# EasyEDA Pro project 1.eprj

# Schematic TEST
Create Date: 2023-04-09; Page Name: P1; Project Name: New Project_2023-04-09_10-10-50; Schematic Name: TEST; Update Date: 2023-04-14; Company: 嘉立创EDA; Page Size: A4; Version: V1.0
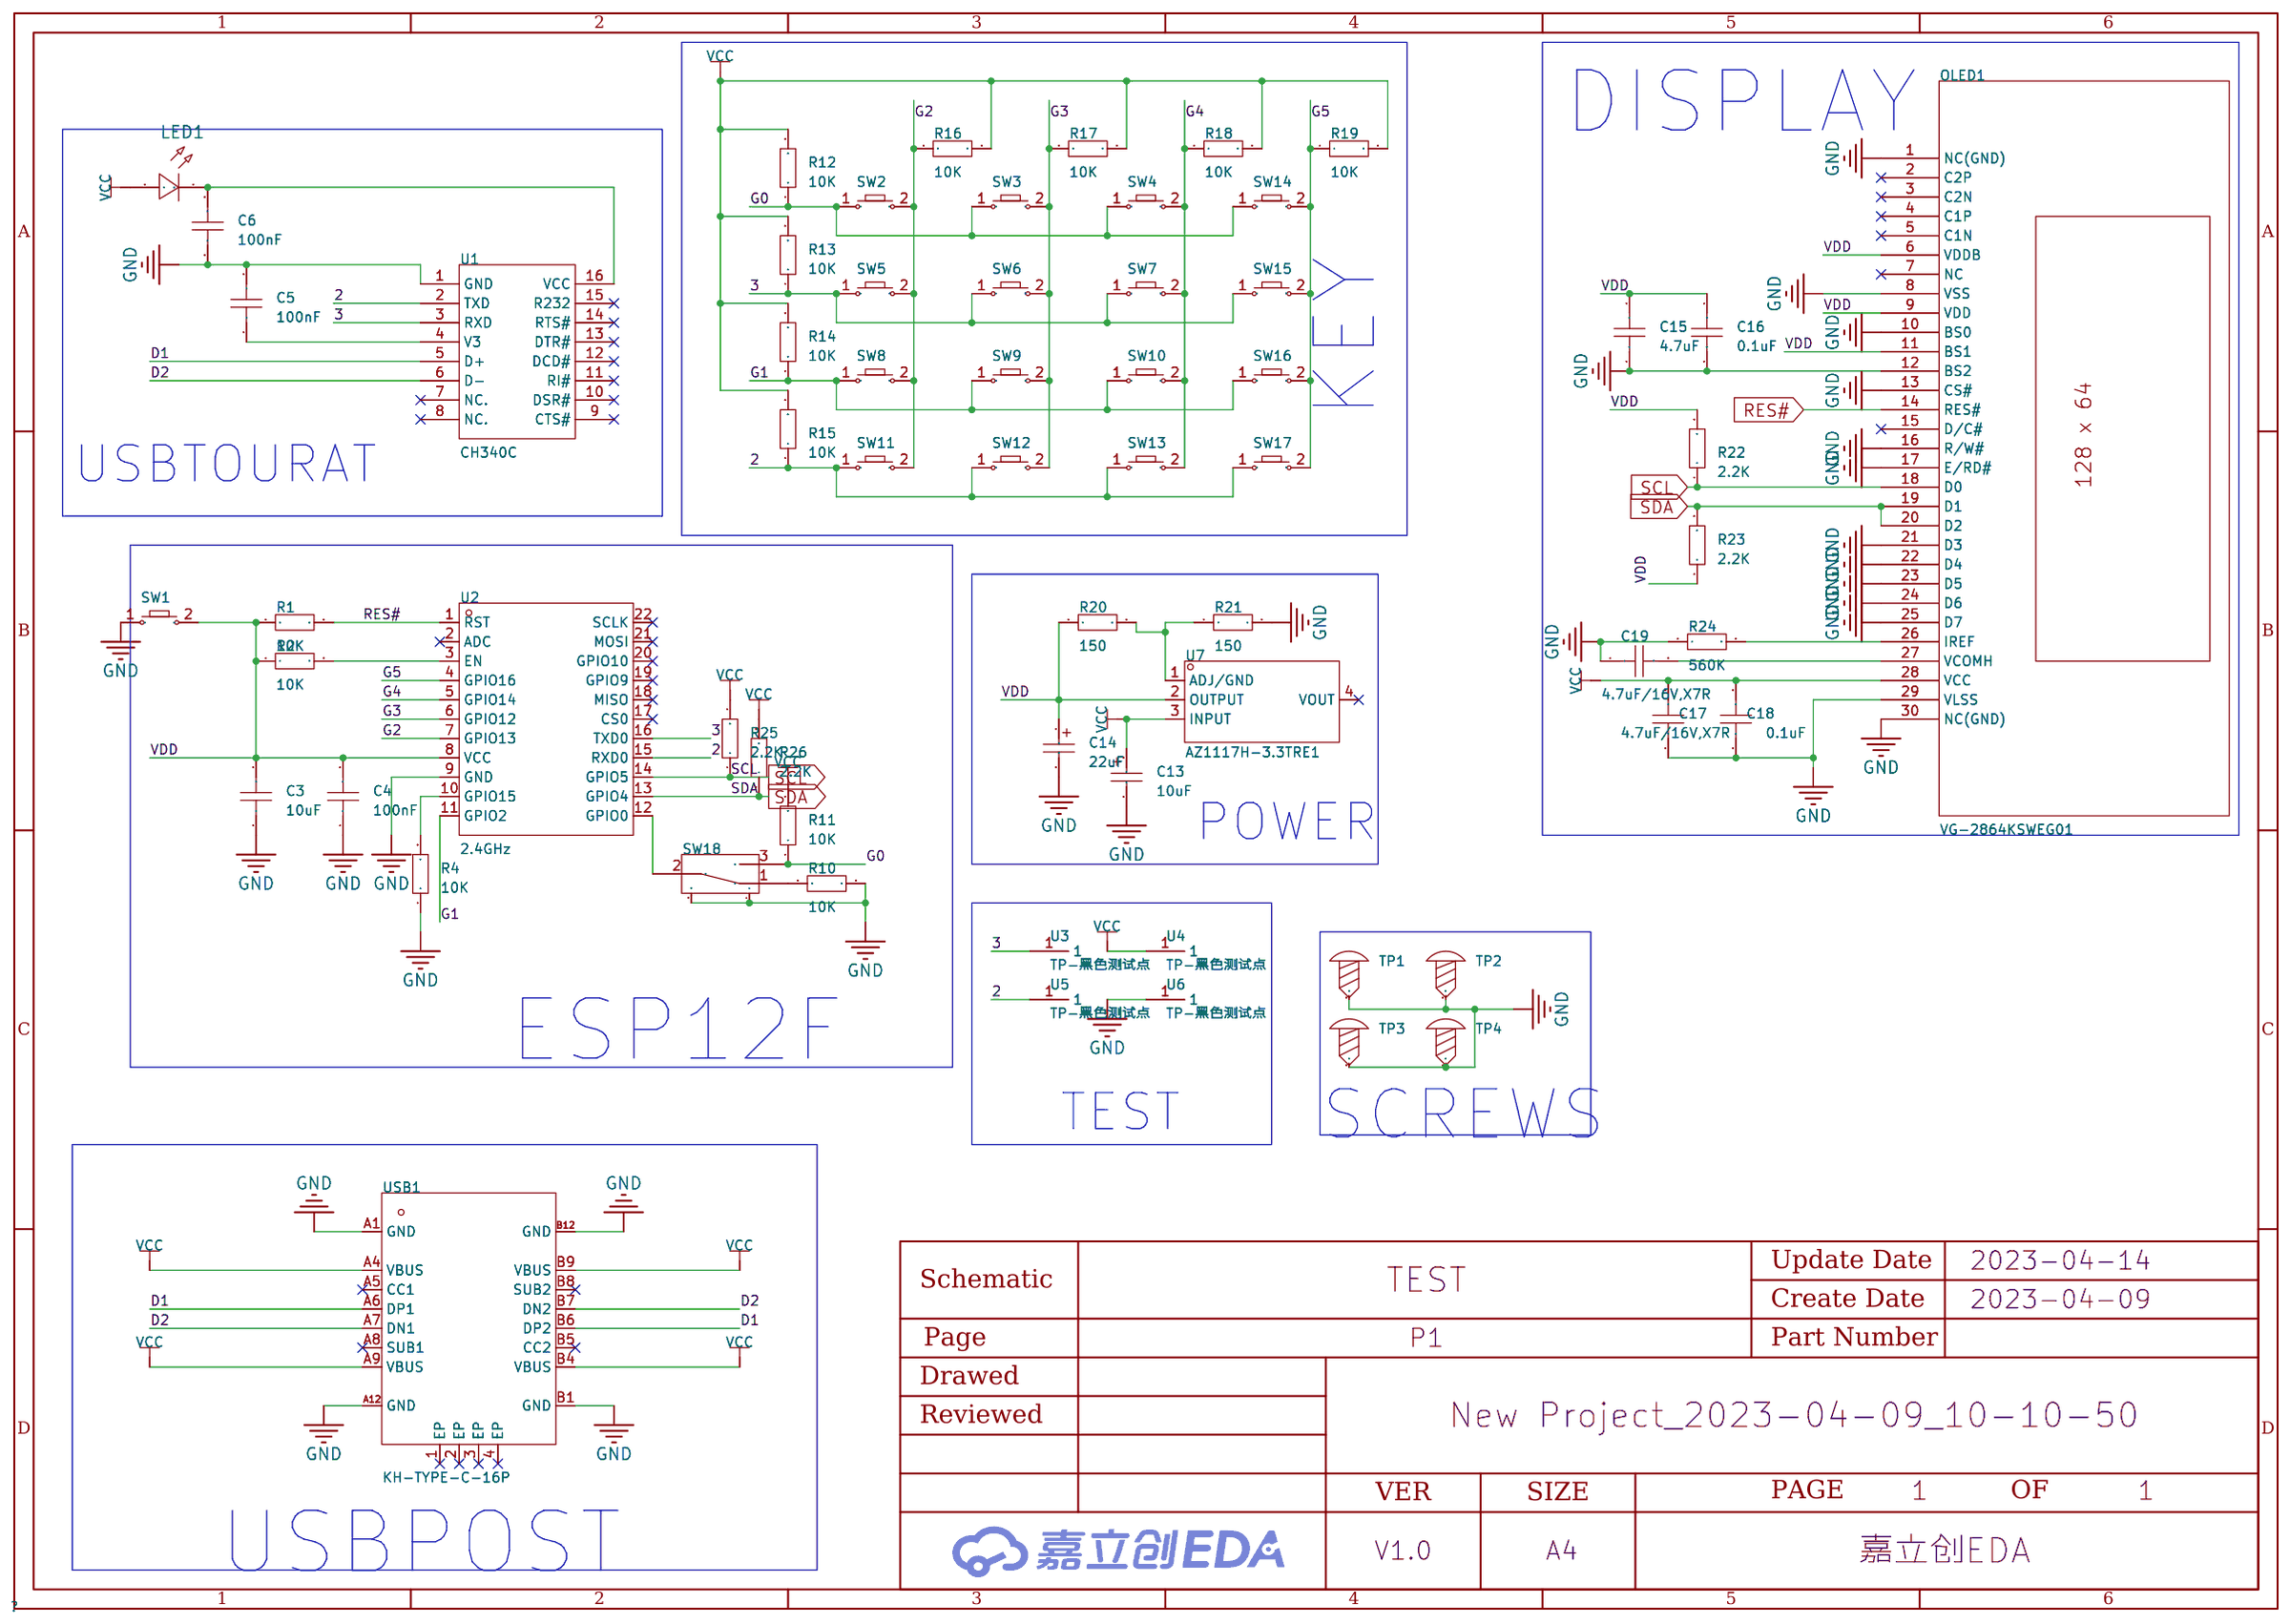
[diagram p0: schematic sheet]

## Parts
C3  10uF  [C0805]
C4  100nF  [C0805]
C5  100nF  [C0805]
C6  100nF  [C0805]
C13  10uF  [CAP-SMD_L3.2-W1.6-RD-C7171]
C14  22uF  [CASE-B_3528]
C15  4.7uF  [C0805]
C16  0.1uF  [C0805]
C17  4.7uF/16V,X7R  [C0805]
C18  0.1uF  [C0805]
C19  4.7uF/16V,X7R  [C0805]
LED1  -  [LED_0805]
OLED1  VG-2864KSWEG01  [OLED_0.96-30P-P0.70-12864]
R1  10K  [R0805]
R2  10K  [R0805]
R4  10K  [R0805]
R10  10K  [R0805]
R11  10K  [R0805]
R12  10K  [R0805]
R13  10K  [R0805]
R14  10K  [R0805]
R15  10K  [R0805]
R16  10K  [R0805]
R17  10K  [R0805]
R18  10K  [R0805]
R19  10K  [R0805]
R20  150  [R0805]
R21  150  [R0805]
R22  2.2K  [R0805]
R23  2.2K  [R0805]
R24  560K  [R0805]
R25  2.2K  [R0805]
R26  2.2K  [R0805]
SW1  -  [Key_SMD_3x4x2]
SW2  -  [Key_SMD_3x4x2]
SW3  -  [Key_SMD_3x4x2]
SW4  -  [Key_SMD_3x4x2]
SW5  -  [Key_SMD_3x4x2]
SW6  -  [Key_SMD_3x4x2]
SW7  -  [Key_SMD_3x4x2]
SW8  -  [Key_SMD_3x4x2]
SW9  -  [Key_SMD_3x4x2]
SW10  -  [Key_SMD_3x4x2]
SW11  -  [Key_SMD_3x4x2]
SW12  -  [Key_SMD_3x4x2]
SW13  -  [Key_SMD_3x4x2]
SW14  -  [Key_SMD_3x4x2]
SW15  -  [Key_SMD_3x4x2]
SW16  -  [Key_SMD_3x4x2]
SW17  -  [Key_SMD_3x4x2]
SW18  -  [拨动开关_侧]
TP1  -  [M2螺丝]
TP2  -  [M2螺丝]
TP3  -  [M2螺丝]
TP4  -  [M2螺丝]
U1  CH340C  [SOP-16_L10.0-W3.9-P1.27-LS6.0-BL]
U2  2.4GHz  [WIFIM-SMD_ESP-12F-ESP8266MOD]
U3  TP-黑色测试点  [TESTPOINT-TH_BD3.2]
U4  TP-黑色测试点  [TESTPOINT-TH_BD3.2]
U5  TP-黑色测试点  [TESTPOINT-TH_BD3.2]
U6  TP-黑色测试点  [TESTPOINT-TH_BD3.2]
U7  AZ1117H-3.3TRE1  [SOT-223-3_L6.5-W3.4-P2.30-LS7.0-BR]
USB1  KH-TYPE-C-16P  [USB-C-SMD_KH-TYPE-C-16P]

## Library data of the parts
C3-C6 C15-C19 = CAP_0805: Supplier Footprint: 0805
C13 = TAJA106K016RNJ: 容值:10uF;精度:±10%;额定电压:16V;等效串联电阻:3Ω@100kHz;; LCSC Part Name: 10uF ±10% 16V; Supplier Part: C7171; Manufacturer: Kyocera AVX; Supplier Footprint: CASE-A-3216; JLCPCB Part Class: Basic Part; Datasheet: https://atta.szlcsc.com/upload/public/pdf/source/20160107/1457707748093.pdf; Supplier: LCSC; Tolerance: ±10%; Rated Voltage: 16V; Equivalent Series Resistance(ESR): 3Ω@100kHz; Operating Temperature: -55℃~+125℃
C14 = TAJB226K016RNJ: 容值:22uF;精度:±10%;额定电压:16V;等效串联电阻:2.3Ω@100kHz;; LCSC Part Name: 22uF ±10% 16V; Supplier Part: C8020; Manufacturer: Kyocera AVX; Supplier Footprint: CASE-B-3528; JLCPCB Part Class: Extended Part; Datasheet: https://atta.szlcsc.com/upload/public/pdf/source/20160107/1457707749964.pdf; Supplier: LCSC; Tolerance: ±10%; Rated Voltage: 16V; Equivalent Series Resistance(ESR): 2.3Ω@100kHz; Operating Temperature: -55℃~+125℃
LED1 = LED_0805-R: Supplier Footprint: 0805
OLED1 = VG-2864KSWEG01: 尺寸(inch):0.96;主控芯片:SSD1306;; LCSC Part Name: 0.96”128x64白色 VG-2864KSWEG01; Supplier Part: C194313; Manufacturer: WiseChip(智晶光电); JLCPCB Part Class: Extended Part; Datasheet: https://atta.szlcsc.com/upload/public/pdf/source/20190118/C194313_EB7CEF44C1C1CB8B071218A368D72B17.pdf; Supplier: LCSC; Size: 0.96; Main Control Chip: SSD1306
R1 R2 R4 R10-R26 = Res_0805: Supplier Footprint: 0805
SW1-SW17 = Key_SMD_3x4x2: Supplier Footprint: SMD
SW18 = 拨动开关_侧: Supplier Footprint: 插件
TP1-TP4 = M2螺丝: Supplier Footprint: 插件
U1 = CH340C: 驱动器/接收器数:-;协议类别:USB 2.0;类型:Transceiver;数据速率:2Mbps;; Supplier Part: C84681; Manufacturer: WCH(南京沁恒); Supplier Footprint: SOP-16_150mil; JLCPCB Part Class: Extended Part; Datasheet: https://atta.szlcsc.com/upload/public/pdf/source/20200819/C84681_ADBED554CE321879DBD6B1D06488689C.pdf; Supplier: LCSC; Protocol: USB 2.0; Type: Transceiver; Supply Voltage: 3.3V, 5V; Data Rate: 2Mbps
U2 = ESP-12F(ESP8266MOD): 频率:2.4GHz;发射功率:16dBm;核心处理器:ESP8266;天线形式:PCB 板载天线;接收灵敏度:-90dBm;; Supplier Part: C82891; Manufacturer: Ai-Thinker(安信可); Supplier Footprint: SMD,16x24mm; JLCPCB Part Class: Extended Part; Datasheet: https://atta.szlcsc.com/upload/public/pdf/source/20210219/C82891_ABD84A460F4F056A2757267CCCA4B508.pdf; Supplier: LCSC; Output Power: 16dBm; Core Processor: ESP8266; Support Interface: GPIO；UART；I2C；PWM；SPI；ADC; Antenna Type: PCB 板载天线; Wireless Standard: 802.11b/g/n; Operating Voltage: 3.3V; Receive  Current: 120mA; Send  Current: 170mA; Sensitivity: -90dBm; Operating Temperature: -40℃~+85℃
U3-U6 = TP-黑色测试点: Supplier Part: C9900007426; Supplier Footprint: TESTPOINT-TH_BD-2P-P2.00; JLCPCB Part Class: Extended Part; Supplier: LCSC
U7 = AZ1117H-3.3TRE1: 最大输入电压:15V;压降(max):1.25V @ 1A;输出电压(可调):-;静态电流(Iq):-;输出类型:固定;输出电压(固定):3.3V;; Supplier Part: C92517; Manufacturer: DIODES(美台); Supplier Footprint: SOT-223; JLCPCB Part Class: Extended Part; Datasheet: https://atta.szlcsc.com/upload/public/pdf/source/20170213/1486952240805.pdf; Supplier: LCSC; Voltage - Input (Max): 15V; Voltage Dropout (Max): 1.25V @ 1A; Output Current (Max): 1A; Output Configuration: 正; Ripple Rejection (PSRR): 75dB(120Hz); Output Type: 固定; Number of Output Channels: 1; Operating Temperature: -40℃~125℃(TJ); Voltage - Output (Fixed): 3.3V
USB1 = KH-TYPE-C-16P: Type-C母座 16PIN 立式四角贴板无压片; LCSC Part Name: Type-C母座; Supplier Part: C709357; Manufacturer: kinghelm(金航标); JLCPCB Part Class: Extended Part; Datasheet: https://atta.szlcsc.com/upload/public/pdf/source/20200911/C709357_AA8DCEB38BB20E3035A7ED7AE7667837.pdf; Supplier: LCSC

## Nets
GND: C3.1 C4.1 C5.2 C6.1 C13.2 C14.2 C15.2 C16.2 C17.1 C18.1 C19.1 OLED1.1(NC(GND)) OLED1.8(VSS) OLED1.10(BS0) OLED1.12(BS2) OLED1.13(CS#) OLED1.16(R/W#) OLED1.17(E/RD#) OLED1.21(D3) OLED1.22(D4) OLED1.23(D5) OLED1.24(D6) OLED1.25(D7) OLED1.29(VLSS) OLED1.30(NC(GND)) R4.1 R10.2 R21.2 R24.1 SW1.1 SW18.4 SW18.5 TP1.1 TP2.1 TP3.1 TP4.1 U1.1(GND) U2.9(GND) U6.1 USB1.A1(GND) USB1.A12(GND) USB1.B1(GND) USB1.B12(GND)
VCC: C13.1 C17.2 C18.2 LED1.2(A) OLED1.28(VCC) R11.2 R12.2 R13.2 R14.2 R15.2 R16.2 R17.2 R18.2 R19.2 R25.2 R26.2 U4.1 U7.3(INPUT) USB1.A4(VBUS) USB1.A9(VBUS) USB1.B4(VBUS) USB1.B9(VBUS)
VDD: C3.2 C4.2 C14.1 C15.1 C16.1 OLED1.6(VDDB) OLED1.9(VDD) OLED1.11(BS1) R1.1 R2.1 R20.1 R22.2 R23.1 SW1.2 U2.8(VCC) U7.2(OUTPUT)
2: R15.1 SW11.1 SW12.1 SW13.1 SW17.1 U1.2(TXD) U2.15(RXD0) U5.1
3: R13.1 SW5.1 SW6.1 SW7.1 SW15.1 U1.3(RXD) U2.16(TXD0) U3.1
D1: U1.5(D+) USB1.A6(DP1) USB1.B6(DP2)
D2: U1.6(D-) USB1.A7(DN1) USB1.B7(DN2)
G0: R11.1 R12.1 SW2.1 SW3.1 SW4.1 SW14.1 SW18.3
G1: R14.1 SW8.1 SW9.1 SW10.1 SW16.1 U2.11(GPIO2)
G2: R16.1 SW2.2 SW5.2 SW8.2 SW11.2 U2.7(GPIO13)
G3: R17.1 SW3.2 SW6.2 SW9.2 SW12.2 U2.6(GPIO12)
G4: R18.1 SW4.2 SW7.2 SW10.2 SW13.2 U2.5(GPIO14)
G5: R19.1 SW14.2 SW15.2 SW16.2 SW17.2 U2.4(GPIO16)
RES#: OLED1.14(RES#) R1.2 U2.1(RST)
SCL: OLED1.18(D0) R22.1 R25.1 U2.14(GPIO5)
SDA: OLED1.19(D1) OLED1.20(D2) R23.2 R26.1 U2.13(GPIO4)
$1N211: C5.1 U1.4(V3)
$1N397: C6.2 LED1.1(C) U1.16(VCC)
$1N1350: R2.2 U2.3(EN)
$1N1471: R4.2 U2.10(GPIO15)
$1N1478: SW18.2 U2.12(GPIO0)
$1N3612: R10.1 SW18.1
$1N7471: R20.2 R21.1 U7.1(ADJ/GND)
$1N8121: OLED1.26(IREF) R24.2
$1N8216: C19.2 OLED1.27(VCOMH)

Not connected (* = marked no-connect by the designer): OLED1 2(C2P)* 3(C2N)* 4(C1P)* 5(C1N)* 7(NC)* 15(D/C#)*; U1 7(NC.)* 8(NC.)* 9(CTS#)* 10(DSR#)* 11(RI#)* 12(DCD#)* 13(DTR#)* 14(RTS#)* 15(R232)*; U2 2(ADC)* 17(CS0)* 18(MISO)* 19(GPIO9)* 20(GPIO10)* 21(MOSI)* 22(SCLK)*; U7 4(VOUT)*; USB1 1(EP)* 2(EP)* 3(EP)* 4(EP)* A5(CC1)* A8(SUB1)* B5(CC2)* B8(SUB2)*

## Notes on the sheet
- DISPLAY
- KEY
- USBTOURAT
- POWER
- ESP12F
- TEST
- SCREWS
- USBPOST

# Board PCB2
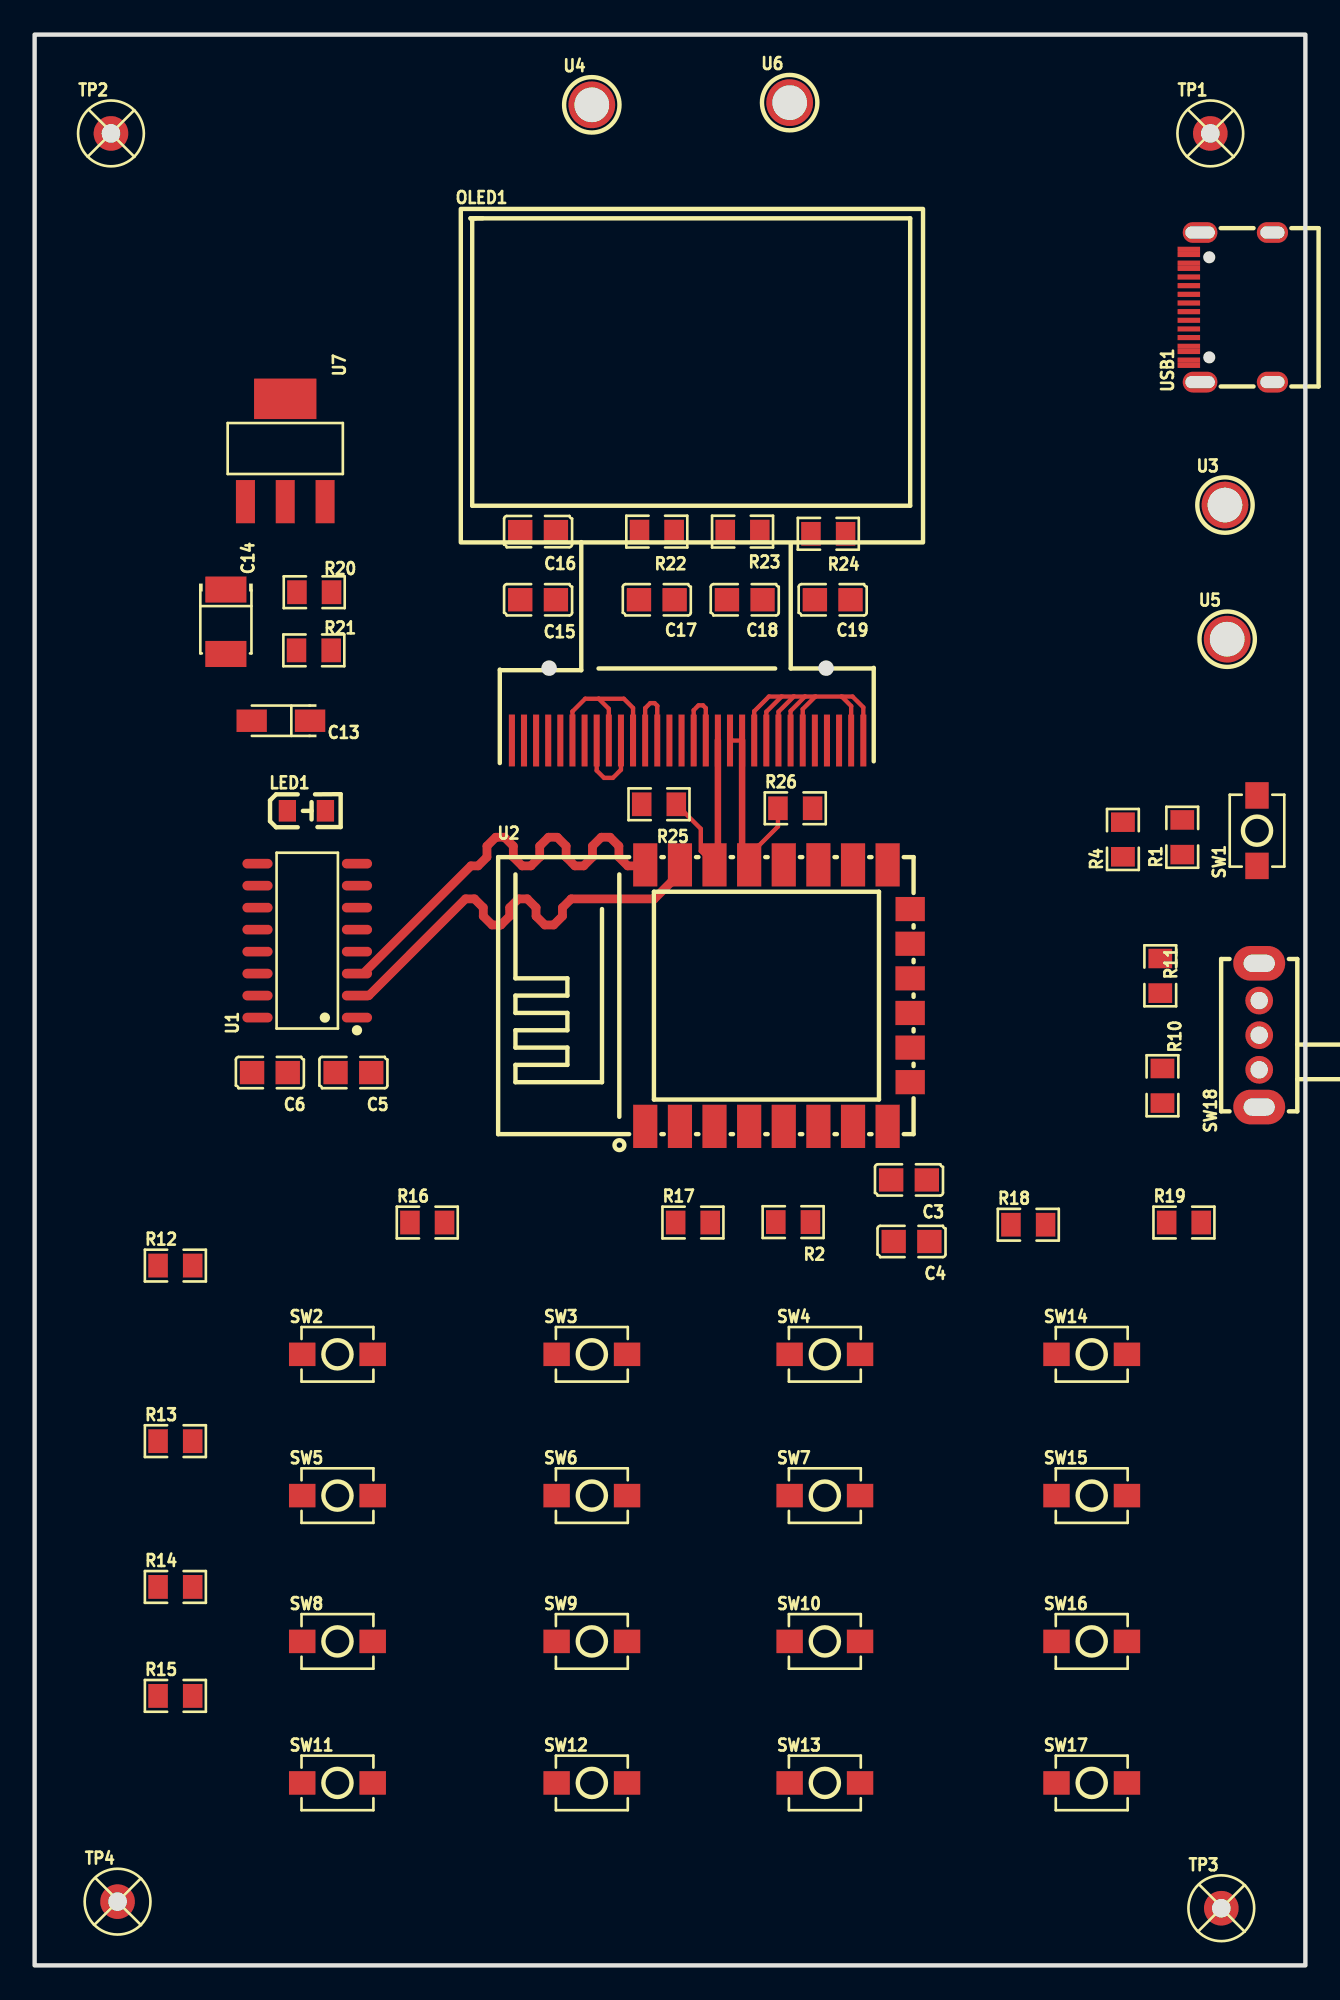
[diagram p1: board, top side]
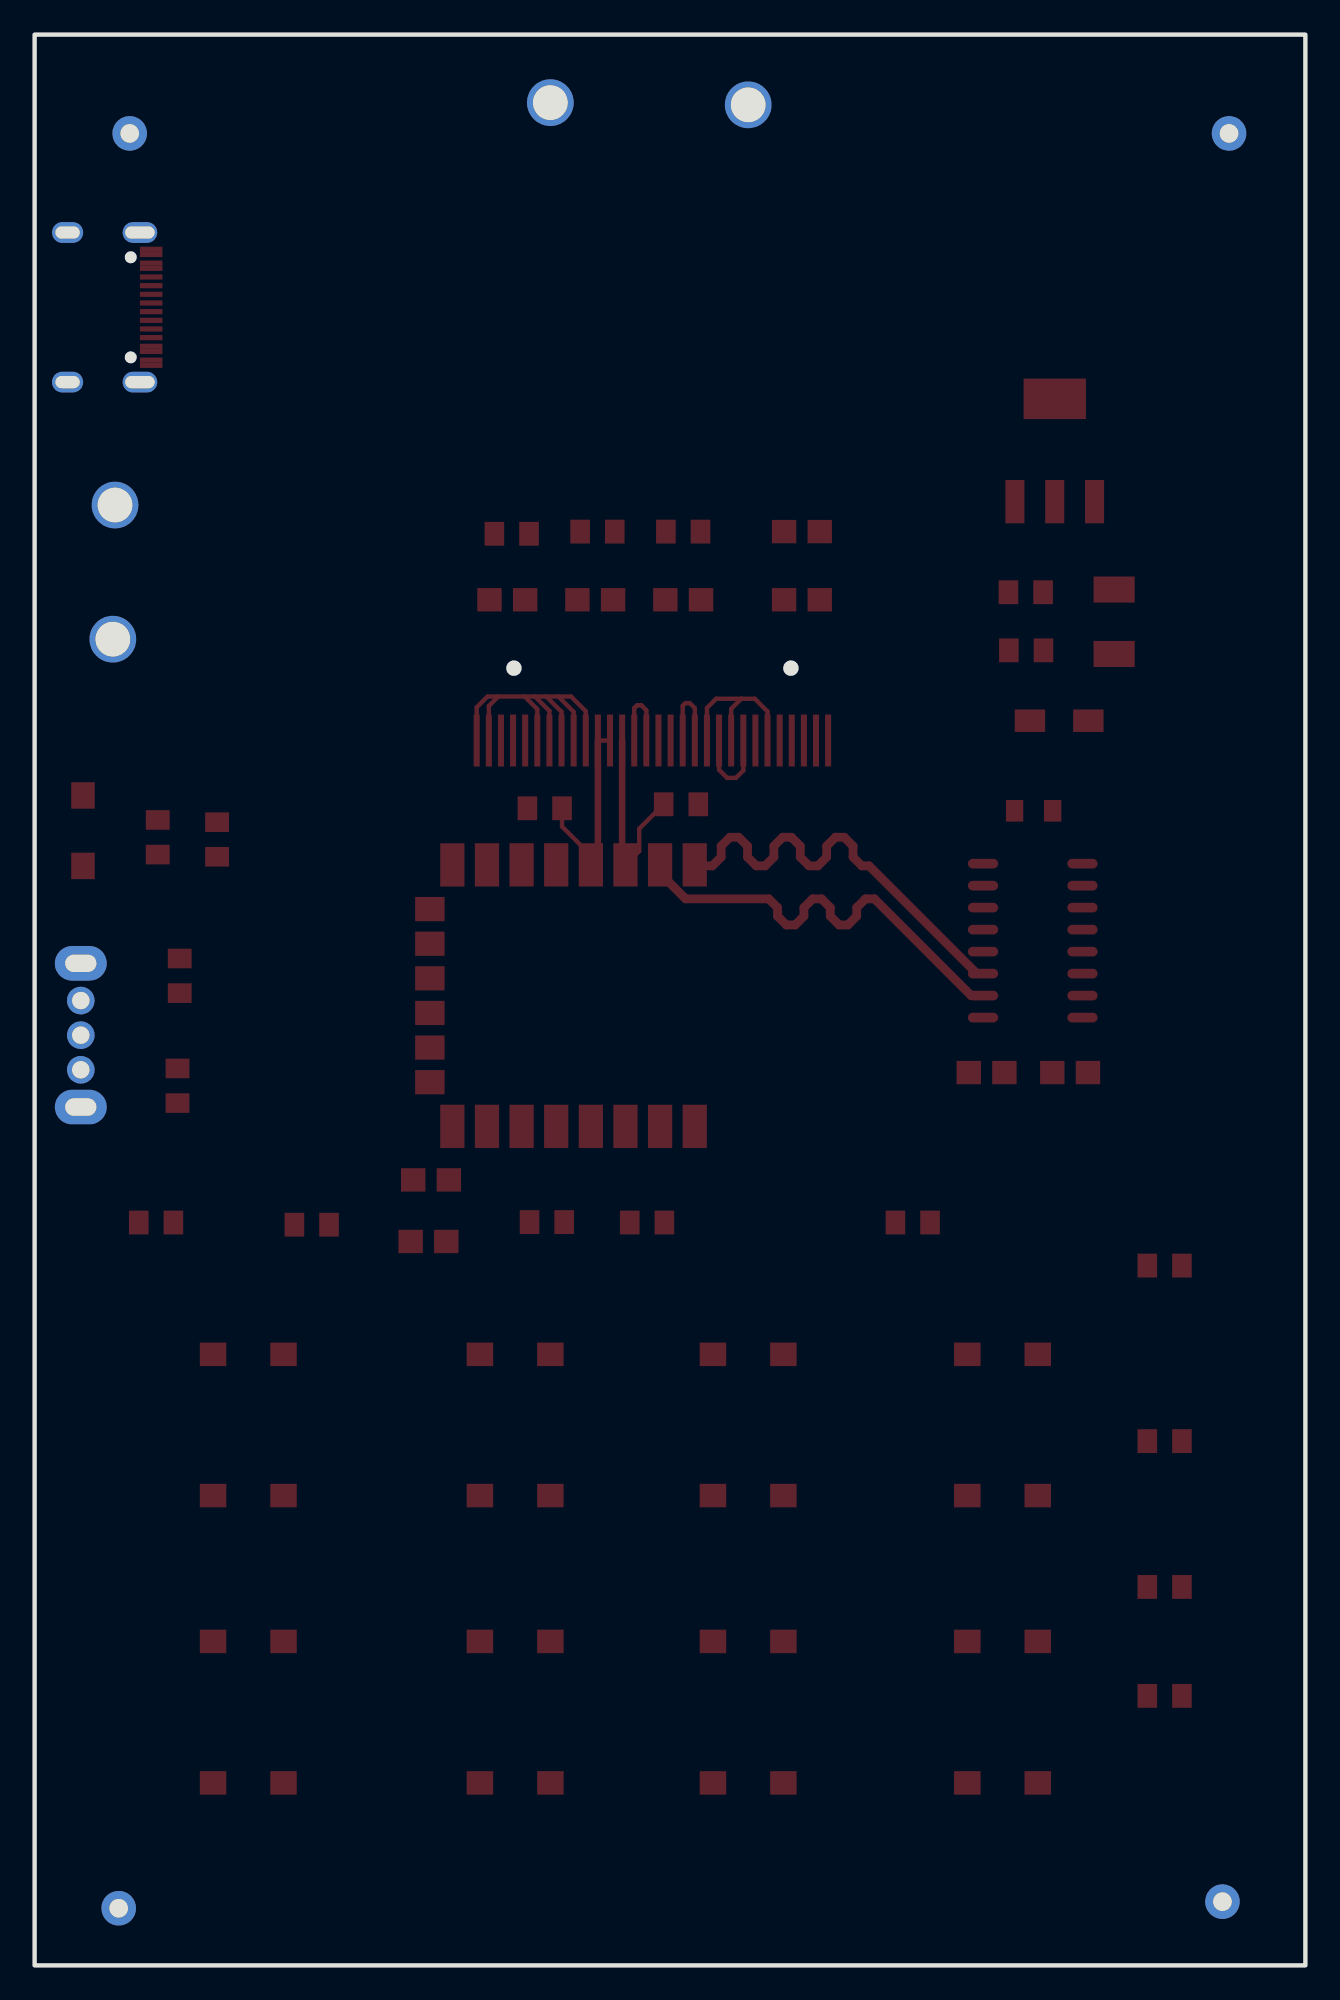
[diagram p2: board, bottom side, seen from below]

Outline 73.41 x 111.51 mm; copper layers: Top Layer, Bottom Layer. Coordinates in mm from the lower left corner of the outline.
Outline path: rectangle 0,111.51 73.41,0
Stack: Top Layer 0.035mm / Dielectric1 1.51mm FR4 er 4.5 / Bottom Layer 0.035mm

## Design rules (mm)
template: JLCPCB Capability(Two Layers Board)
spacing copperThickness1oz (default): track to track 0.102, other pairs 0.152 to 0.3
spacing copperThickness2oz: track to track 0.203, other pairs 0.152 to 0.3
track width copperThickness1oz (default): min 0.127, default 0.254, max 2.54
track width copperThickness2oz: min 0.203, default 0.254, max 2.54
differential pair differentialPair (default): width min 0.127, default 0.254, max 2.54; gap min 0.152, default 0.152
via viaSize (default): diameter min 0.5, default 0.61, max 10; hole min 0.3, default 0.305, max 6.3

## Placement (name value [footprint] x y rotation side)
C3  10uF  [C0805]  50.51 45.36 180 top
C4  100nF  [C0805]  50.65 41.81 180 top
C5  100nF  [C0805]  18.42 51.56 180 top
C6  100nF  [C0805]  13.59 51.56 180 top
C13  10uF  [CAP-SMD_L3.2-W1.6-RD-C7171]  14.22 71.88 180 top
C14  22uF  [CASE-B_3528]  11.05 77.6 270 top
C15  4.7uF  [C0805]  29.08 78.87 180 top
C16  0.1uF  [C0805]  29.08 82.8 180 top
C17  4.7uF/16V,X7R  [C0805]  35.94 78.87 0 top
C18  0.1uF  [C0805]  41.02 78.87 0 top
C19  4.7uF/16V,X7R  [C0805]  46.1 78.87 0 top
LED1  -  [LED_0805]  15.75 66.68 0 top
OLED1  VG-2864KSWEG01  [OLED_0.96-30P-P0.70-12864]  37.72 70.74 0 top
R1  10K  [R0805]  66.29 65.15 90 top
R2  10K  [R0805]  43.81 42.93 180 top
R4  10K  [R0805]  62.86 65.02 90 top
R10  10K  [R0805]  65.15 50.8 270 top
R11  10K  [R0805]  65.02 57.15 90 top
R12  10K  [R0805]  8.13 40.42 0 top
R13  10K  [R0805]  8.13 30.28 0 top
R14  10K  [R0805]  8.13 21.86 0 top
R15  10K  [R0805]  8.13 15.56 0 top
R16  10K  [R0805]  22.68 42.9 0 top
R17  10K  [R0805]  38.03 42.9 0 top
R18  10K  [R0805]  57.4 42.77 0 top
R19  10K  [R0805]  66.39 42.9 0 top
R20  150  [R0805]  16.15 79.3 180 top
R21  150  [R0805]  16.13 75.95 0 top
R22  2.2K  [R0805]  35.94 82.8 180 top
R23  2.2K  [R0805]  40.89 82.8 0 top
R24  560K  [R0805]  45.85 82.68 0 top
R25  2.2K  [R0805]  36.07 67.06 180 top
R26  2.2K  [R0805]  43.94 66.83 0 top
SW1  -  [Key_SMD_3x4x2]  70.61 65.53 90 top
SW2  -  [Key_SMD_3x4x2]  17.49 35.29 0 top
SW3  -  [Key_SMD_3x4x2]  32.19 35.29 0 top
SW4  -  [Key_SMD_3x4x2]  45.65 35.29 0 top
SW5  -  [Key_SMD_3x4x2]  17.49 27.13 0 top
SW6  -  [Key_SMD_3x4x2]  32.19 27.13 0 top
SW7  -  [Key_SMD_3x4x2]  45.65 27.13 0 top
SW8  -  [Key_SMD_3x4x2]  17.49 18.71 0 top
SW9  -  [Key_SMD_3x4x2]  32.19 18.71 0 top
SW10  -  [Key_SMD_3x4x2]  45.65 18.71 0 top
SW11  -  [Key_SMD_3x4x2]  17.49 10.54 0 top
SW12  -  [Key_SMD_3x4x2]  32.19 10.54 0 top
SW13  -  [Key_SMD_3x4x2]  45.65 10.54 0 top
SW14  -  [Key_SMD_3x4x2]  61.06 35.29 0 top
SW15  -  [Key_SMD_3x4x2]  61.06 27.13 0 top
SW16  -  [Key_SMD_3x4x2]  61.06 18.71 0 top
SW17  -  [Key_SMD_3x4x2]  61.06 10.54 0 top
SW18  -  [拨动开关_侧]  70.74 53.72 90 top
TP1  -  [M2螺丝]  67.91 105.8 0 top
TP2  -  [M2螺丝]  4.41 105.8 0 top
TP3  -  [M2螺丝]  68.55 3.3 0 top
TP4  -  [M2螺丝]  4.79 3.68 0 top
U1  CH340C  [SOP-16_L10.0-W3.9-P1.27-LS6.0-BL]  15.75 59.18 90 top
U2  2.4GHz  [WIFIM-SMD_ESP-12F-ESP8266MOD]  42.93 56.01 0 top
U3  TP-黑色测试点  [TESTPOINT-TH_BD3.2]  68.76 84.34 0 top
U4  TP-黑色测试点  [TESTPOINT-TH_BD3.2]  32.19 107.45 0 top
U5  TP-黑色测试点  [TESTPOINT-TH_BD3.2]  68.89 76.59 0 top
U6  TP-黑色测试点  [TESTPOINT-TH_BD3.2]  43.62 107.58 0 top
U7  AZ1117H-3.3TRE1  [SOT-223-3_L6.5-W3.4-P2.30-LS7.0-BR]  14.48 87.5 270 top
USB1  KH-TYPE-C-16P  [USB-C-SMD_KH-TYPE-C-16P]  69.09 95.76 90 top

## Footprints (pads in the part's own frame, mm; a bottom-side part is the same pattern mirrored in y, then rotated)
C0805
  rect 1.41x1.35 smd: 1(-1.03,0) 2(1.03,0)
CAP-SMD_L3.2-W1.6-RD-C7171
  rect 1.758x1.296 smd: 1(-1.687,0) 2(1.687,0)
CASE-B_3528
  rect 1.506x2.376 smd: 1(-1.861,0) 2(1.861,0)
Key_SMD_3x4x2
  rect 1.53x1.36 smd: 1(-2.035,0) 2(2.035,0)
LED_0805
  rect 1x1.25 smd: 1(-1.15,0.005) 2(1.05,0.005)
M2螺丝
  round 2 hole 1.07: 1(0,0)
OLED_0.96-30P-P0.70-12864
  rect 0.35x3 smd: 1(-10.15,0.003) 2(-9.45,0.001) 3(-8.75,0.001) 4(-8.05,0.001) 5(-7.35,0.001) 6(-6.65,0.001) 7(-5.95,0.001) 8(-5.25,0.001) 9(-4.55,0.001) 10(-3.85,0.001) 11(-3.15,0.001) 12(-2.45,0.001) 13(-1.75,0.001) 14(-1.05,0.001) 15(-0.35,0.001) 16(0.35,0.001) 17(1.05,0.001) 18(1.75,0.001) 19(2.45,0.001) 20(3.15,0.001) 21(3.85,0.001) 22(4.55,0.001) 23(5.25,0.001) 24(5.95,0.001) 25(6.65,0.001) 26(7.35,0.001) 27(8.05,0.001) 28(8.75,-0.002) 29(9.45,-0.003) 30(10.15,-0.003)
R0805
  rect 1.133x1.377 smd: 1(-1,0) 2(1,0)
SOP-16_L10.0-W3.9-P1.27-LS6.0-BL
  oval 0.56x1.745 smd: 1(-4.445,-2.873) 2(-3.175,-2.873) 3(-1.905,-2.873) 4(-0.635,-2.873) 5(0.635,-2.873) 6(1.905,-2.873) 7(3.175,-2.873) 8(4.445,-2.873) 9(4.445,2.873) 10(3.175,2.873) 11(1.905,2.873) 12(0.635,2.873) 13(-0.635,2.873) 14(-1.905,2.873) 15(-3.175,2.873) 16(-4.445,2.873)
SOT-223-3_L6.5-W3.4-P2.30-LS7.0-BR
  rect 2.5x1.1 smd: 1(2.97,-2.3) 2(2.97,0) 3(2.97,2.3)
  rect 2.34x3.6 smd: 4(-2.97,0)
TESTPOINT-TH_BD3.2
  round 2.7 hole 2: 1(0,0)
USB-C-SMD_KH-TYPE-C-16P
  oval 1.2x2 hole 0.7x1.7: 1(-4.32,1.765) 2(4.32,1.765)
  oval 1.2x1.8 hole 0.7x1.4: 3(-4.32,-2.415) 4(4.32,-2.415)
  rect 0.3x1.3 smd: A1(-3.35,2.415) A4(-2.55,2.415) A5(-1.25,2.415) A6(-0.25,2.415) A7(0.25,2.415) A8(1.25,2.415) A9(2.55,2.415) A12(3.35,2.415) B1(3.05,2.415) B4(2.25,2.415) B5(1.75,2.415) B6(0.75,2.415) B7(-0.75,2.415) B8(-1.75,2.415) B9(-2.25,2.415) B12(-3.05,2.415)
WIFIM-SMD_ESP-12F-ESP8266MOD
  rect 1.4x2.5 smd: 1(-7.651,-7.551) 2(-5.651,-7.551) 3(-3.651,-7.551) 4(-1.651,-7.551) 5(0.349,-7.551) 6(2.349,-7.551) 7(4.349,-7.551) 8(6.349,-7.551) 9(6.349,7.548) 10(4.349,7.55) 11(2.349,7.551) 12(0.349,7.551) 13(-1.651,7.55) 14(-3.651,7.551) 15(-5.651,7.551) 16(-7.651,7.551)
  rect 1.7x1.4 smd: 17(7.651,-5) 18(7.649,-3.002) 19(7.649,-1.004) 20(7.649,0.998) 21(7.649,2.997) 22(7.651,4.997)
拨动开关_侧
  oval 1.6x1.6 hole 1.001: 1(-1.999,0) 2(0,0) 3(1.999,0)
  oval 1.999x2.999 hole 1.001x1.801: 4(4.151,0) 5(-4.151,0)

## Nets
As in the schematic.

Pads without a net: OLED1 2 3 4 5 7 15; U1 7 8 9 10 11 12 13 14 15; U2 2 17 18 19 20 21 22; U7 4; USB1 1 2 3 4 A5 A8 B5 B8

## Routing (per net, layer and track width the routed paths; a pad name or vN(x,y) marks a point on that pad's centre or on a via; arc(x,y) is an arc through that point)
GND: length 39.3
  Top Layer w0.254: 45.1,73.28 44.37,72.55 OLED1.25 ; 45.1,73.28 44.5,73.28 ; 45.1,73.28 46.62,73.28 ; OLED1.16 38.07,72.49 38.35,72.77 38.61,72.77 38.77,72.61 OLED1.17 ; OLED1.21 41.57,72.43 42.42,73.28 43.15,73.28 ; 44.5,73.28 43.67,72.45 OLED1.24 ; 44.5,73.28 43.85,73.28 ; OLED1.13 35.97,72.74 35.81,72.9 35.56,72.9 35.27,72.61 OLED1.12 ; 43.15,73.28 43.85,73.28 ; 43.15,73.28 42.27,72.4 OLED1.22 ; 43.85,73.28 42.97,72.4 OLED1.23 ; OLED1.8 32.47,69 32.89,68.58 33.4,68.58 33.87,69.05 OLED1.10 ; OLED1.29 47.17,72.73 46.62,73.28 ; OLED1.30 47.87,72.65 47.24,73.28 46.62,73.28
VDD: length 10.2
  Top Layer w0.254: 32.59,73.15 31.8,73.15 31.07,72.42 OLED1.6 ; 32.59,73.15 34.04,73.15 34.57,72.62 OLED1.11 34.56,70.73 ; 32.59,73.15 33.17,72.57 OLED1.9
2: length 25.6
  Top Layer w0.508: U1.2 19.3,56.01 24.89,61.6 25.41,61.6 25.92,61.09 25.92,60.6 26.43,60.09 26.93,60.09 27.44,60.6 27.44,61.09 27.95,61.6 28.46,61.6 28.97,61.09 28.97,60.6 29.47,60.09 29.98,60.09 30.49,60.6 30.49,61.09 31,61.6 35.8,61.6 37.28,63.07 37.28,63.43
3: length 25.6
  Top Layer w0.508: U2.16 35.22,63.5 34.26,63.5 33.75,64.01 33.75,64.64 33.24,65.15 32.73,65.15 32.23,64.64 32.23,64.01 31.72,63.5 31.21,63.5 30.7,64.01 30.7,64.64 30.19,65.15 29.68,65.15 29.18,64.64 29.18,64.01 28.67,63.5 28.16,63.5 27.65,64.01 27.65,64.64 27.14,65.15 26.64,65.15 26.13,64.64 26.13,64.01 25.62,63.5 25.2,63.5 18.98,57.28 U1.3
SCL: length 11.7
  Top Layer w0.254: U2.14 38.48,64.35 38.48,65.64 R25.1
  Top Layer w0.381: U2.14 39.47,63.75 OLED1.18
SDA: length 12
  Top Layer w0.254: R26.1 42.94,65.77 41.28,64.11 U2.13 ; OLED1.19 OLED1.20 40.89,70.71
  Top Layer w0.381: OLED1.20 40.87,63.96 U2.13
